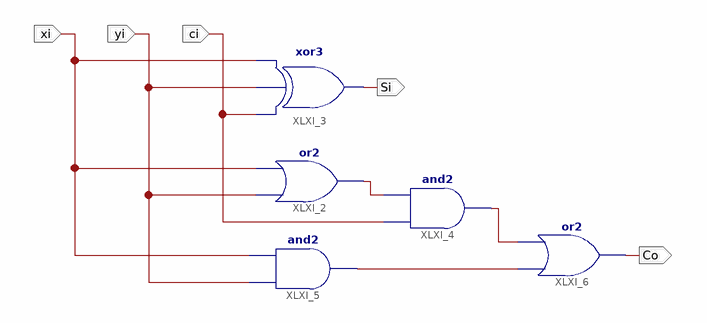
[diagram p0: schematic sheet 1]
// Xilinx ISE schematic sumador_completo_1b.sch (spartan6) as structural Verilog: 5 symbols, 5 ports
module sumador_completo_1b (
  input  xi,
  input  ci,
  input  yi,
  output Co,
  output Si
);

  wire XLXN_8, XLXN_9, XLXN_10;

  or XLXI_2 (XLXN_8, yi, xi);
  xor XLXI_3 (Si, ci, yi, xi);
  and XLXI_4 (XLXN_9, ci, XLXN_8);
  and XLXI_5 (XLXN_10, yi, xi);
  or XLXI_6 (Co, XLXN_10, XLXN_9);
endmodule
